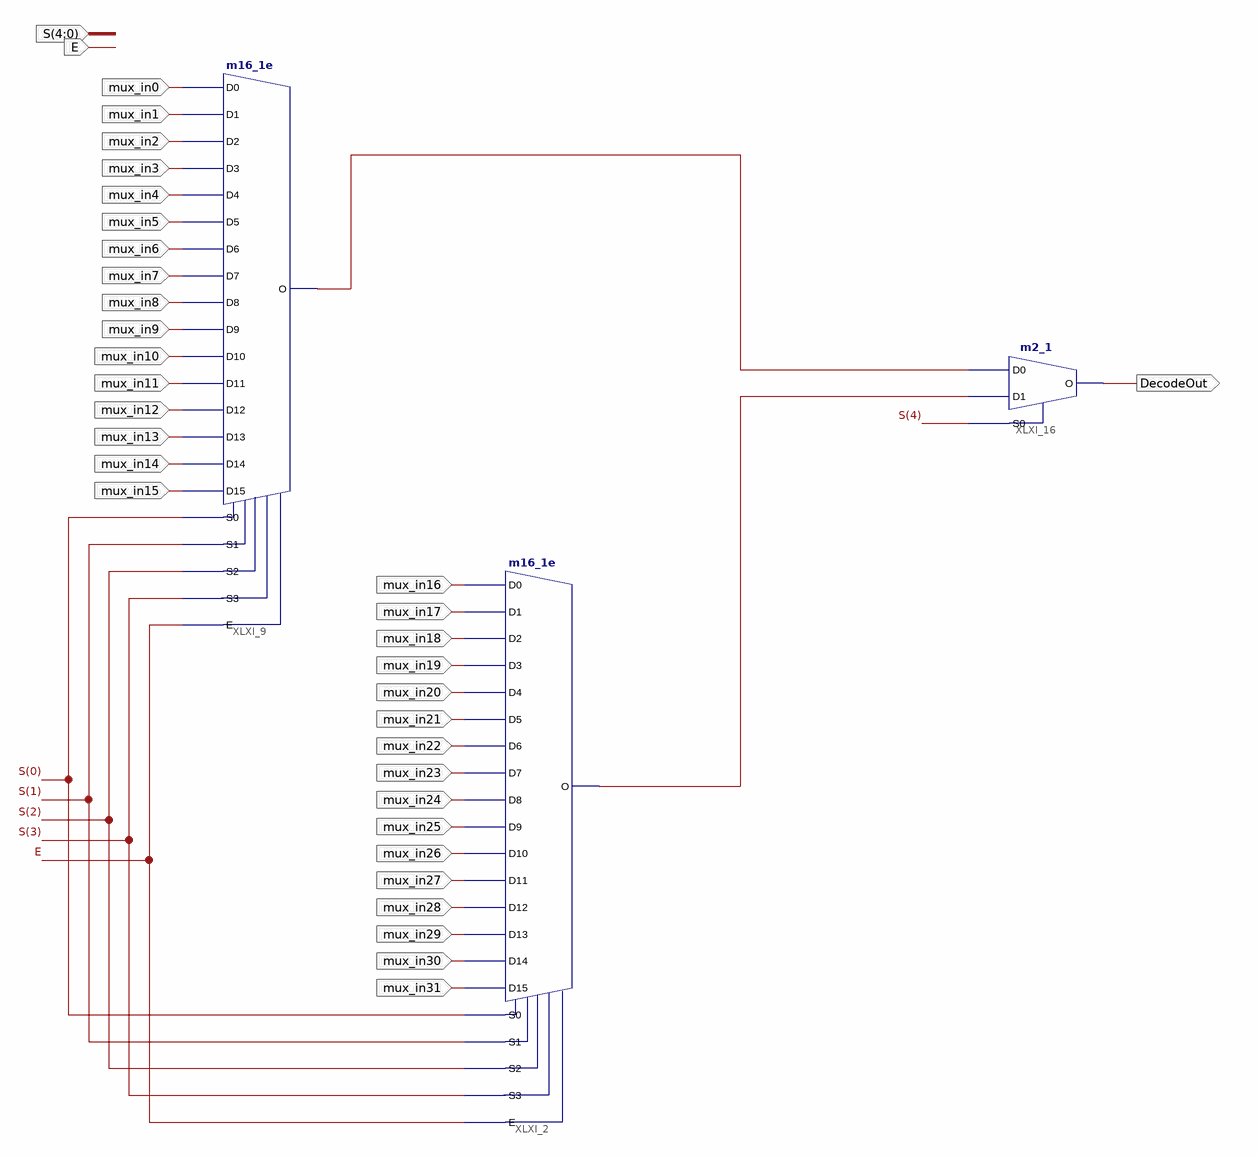
[diagram p0: schematic sheet 1]
// Xilinx ISE schematic signalMux_32.sch (spartan3e) as structural Verilog: 3 symbols, 35 ports
module signalMux_32 (
  input  E,
  input  [4:0] S,
  input  mux_in15,
  input  mux_in14,
  input  mux_in13,
  input  mux_in12,
  input  mux_in11,
  input  mux_in10,
  input  mux_in9,
  input  mux_in8,
  input  mux_in7,
  input  mux_in6,
  input  mux_in5,
  input  mux_in4,
  input  mux_in3,
  input  mux_in2,
  input  mux_in1,
  input  mux_in0,
  input  mux_in16,
  input  mux_in17,
  input  mux_in18,
  input  mux_in19,
  input  mux_in20,
  input  mux_in21,
  input  mux_in22,
  input  mux_in23,
  input  mux_in24,
  input  mux_in25,
  input  mux_in26,
  input  mux_in27,
  input  mux_in28,
  input  mux_in29,
  input  mux_in30,
  input  mux_in31,
  output DecodeOut
);

  wire XLXN_62, XLXN_63;

  m2_1 XLXI_16 (.D0(XLXN_62), .D1(XLXN_63), .S0(S[4]), .O(DecodeOut));
  m16_1e XLXI_9 (
    .D0(mux_in0), .D1(mux_in1), .D10(mux_in10), .D11(mux_in11), .D12(mux_in12), .D13(mux_in13),
    .D14(mux_in14), .D15(mux_in15), .D2(mux_in2), .D3(mux_in3), .D4(mux_in4), .D5(mux_in5), .D6(mux_in6),
    .D7(mux_in7), .D8(mux_in8), .D9(mux_in9), .E(E), .S0(S[0]), .S1(S[1]), .S2(S[2]), .S3(S[3]), .O(XLXN_62));
  m16_1e XLXI_2 (
    .D0(mux_in16), .D1(mux_in17), .D10(mux_in26), .D11(mux_in27), .D12(mux_in28), .D13(mux_in29),
    .D14(mux_in30), .D15(mux_in31), .D2(mux_in18), .D3(mux_in19), .D4(mux_in20), .D5(mux_in21),
    .D6(mux_in22), .D7(mux_in23), .D8(mux_in24), .D9(mux_in25), .E(E), .S0(S[0]), .S1(S[1]), .S2(S[2]),
    .S3(S[3]), .O(XLXN_63));
endmodule
